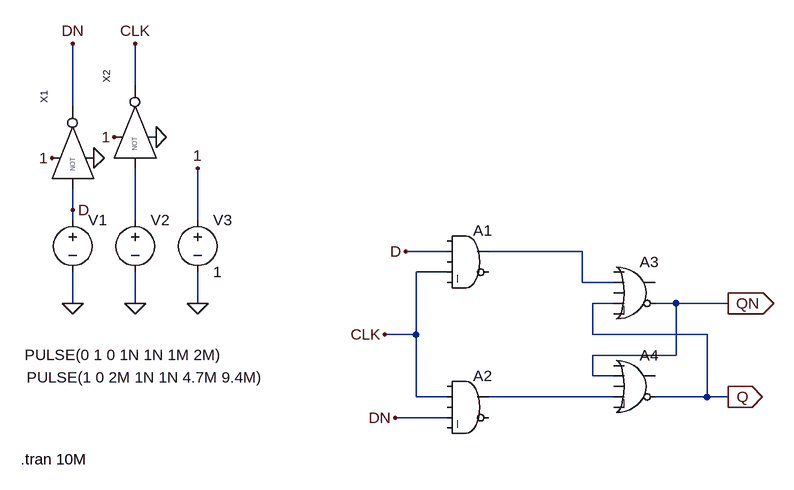
[diagram p0: schematic D_LATCH_SLAYTEXAMPLE.asc]
D_LATCH_SLAYTEXAMPLE.asc, the LTspice schematic file:
Version 4
SHEET 1 880 680
WIRE -464 -272 -464 -336
WIRE -560 -240 -560 -336
WIRE -560 -80 -560 -112
WIRE -560 -64 -560 -80
WIRE -464 -64 -464 -144
WIRE -368 -64 -368 -144
WIRE 16 -16 -48 -16
WIRE 224 -16 80 -16
WIRE 16 16 -32 16
WIRE 224 32 224 -16
WIRE 272 32 224 32
WIRE -560 64 -560 16
WIRE -464 64 -464 16
WIRE -368 64 -368 16
WIRE 272 64 240 64
WIRE 368 64 336 64
WIRE 448 64 368 64
WIRE -32 112 -32 16
WIRE -32 112 -80 112
WIRE 240 112 240 64
WIRE 416 112 240 112
WIRE 368 144 368 64
WIRE 368 144 240 144
WIRE 240 176 240 144
WIRE 272 176 240 176
WIRE -32 208 -32 112
WIRE 16 208 -32 208
WIRE 272 208 80 208
WIRE 416 208 416 112
WIRE 416 208 336 208
WIRE 448 208 416 208
WIRE 16 240 -64 240
FLAG -560 64 0
FLAG -464 64 0
FLAG -528 -160 0
FLAG -368 -144 1
FLAG -592 -160 1
FLAG -560 -336 DN
FLAG -560 -80 D
FLAG -464 -336 CLK
FLAG -80 112 CLK
FLAG -48 -16 D
FLAG -64 240 DN
FLAG 448 64 QN
IOPIN 448 64 Out
FLAG 448 208 Q
IOPIN 448 208 Out
FLAG -368 64 0
FLAG -496 -192 1
FLAG -432 -192 0
SYMBOL Digital\\and 48 -64 R0
SYMATTR InstName A1
SYMBOL Digital\\and 48 160 R0
SYMATTR InstName A2
SYMBOL Digital\\or 304 -16 R0
SYMATTR InstName A3
SYMBOL Digital\\or 304 128 R0
SYMATTR InstName A4
SYMBOL voltage -560 -80 R0
WINDOW 3 -74 223 Left 2
WINDOW 123 0 0 Left 0
WINDOW 39 0 0 Left 0
SYMATTR Value PULSE(0 1 0 1N 1N 1M 2M)
SYMATTR InstName V1
SYMBOL voltage -464 -80 R0
WINDOW 3 -167 258 Left 2
WINDOW 123 0 0 Left 0
WINDOW 39 0 0 Left 0
SYMATTR Value PULSE(1 0 2M 1N 1N 4.7M 9.4M)
SYMATTR InstName V2
SYMBOL NOT4 -544 -176 R270
SYMATTR InstName X1
SYMBOL voltage -368 -80 R0
WINDOW 123 0 0 Left 0
WINDOW 39 0 0 Left 0
SYMATTR InstName V3
SYMATTR Value 1
SYMBOL NOT4 -448 -208 R270
SYMATTR InstName X2
TEXT -640 304 Left 2 !.tran 10M

The netlist it stands for:
* D_LATCH_SLAYTEXAMPLE.asc
A1 0 D 0 CLK 0 0 N002 0 AND
A2 0 CLK 0 DN 0 0 N003 0 AND
A3 0 N002 0 Q 0 QN 0 0 OR
A4 0 QN 0 N003 0 Q 0 0 OR
V1 D 0 PULSE(0 1 0 1N 1N 1M 2M)
V2 N001 0 PULSE(1 0 2M 1N 1N 4.7M 9.4M)
XX1 D 1 0 DN NOT4  ; pins A VH VL OUT
V3 1 0 1
XX2 N001 1 0 CLK NOT4  ; pins A VH VL OUT
.tran 10M
.backanno
.end

* Results of the author's LTspice run, read from the files saved beside the schematic
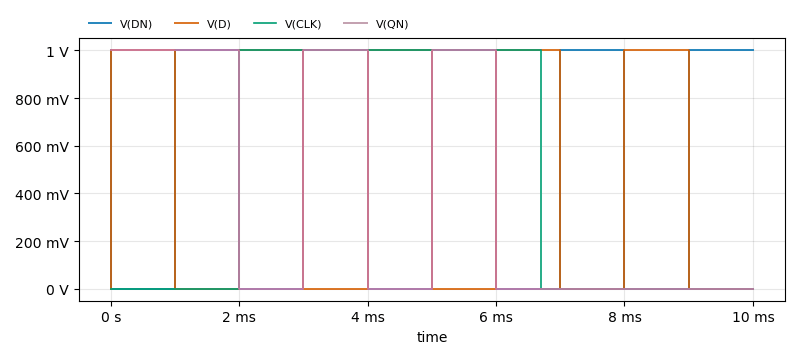
[diagram p1: Transient Analysis of D_LATCH_SLAYTEXAMPLE.asc, plotted from the saved traces]
* Transient Analysis, 1 run:
*   V(DN): min 0 V, max 1 V, average 500 mV, rms 707.1 mV, last 1 V
*   V(D): min 0 V, max 1 V, average 500 mV, rms 707.1 mV, last 0 V
*   V(CLK): min 0 V, max 1 V, average 470 mV, rms 685.6 mV, last 100.5 nV
*   V(QN): min 0 V, max 1 V, average 400 mV, rms 632.5 mV, last 0 V